# Altium schematic sheet Transmitter.SchDoc
size A; SheetNumber: 6; SheetTotal: 6
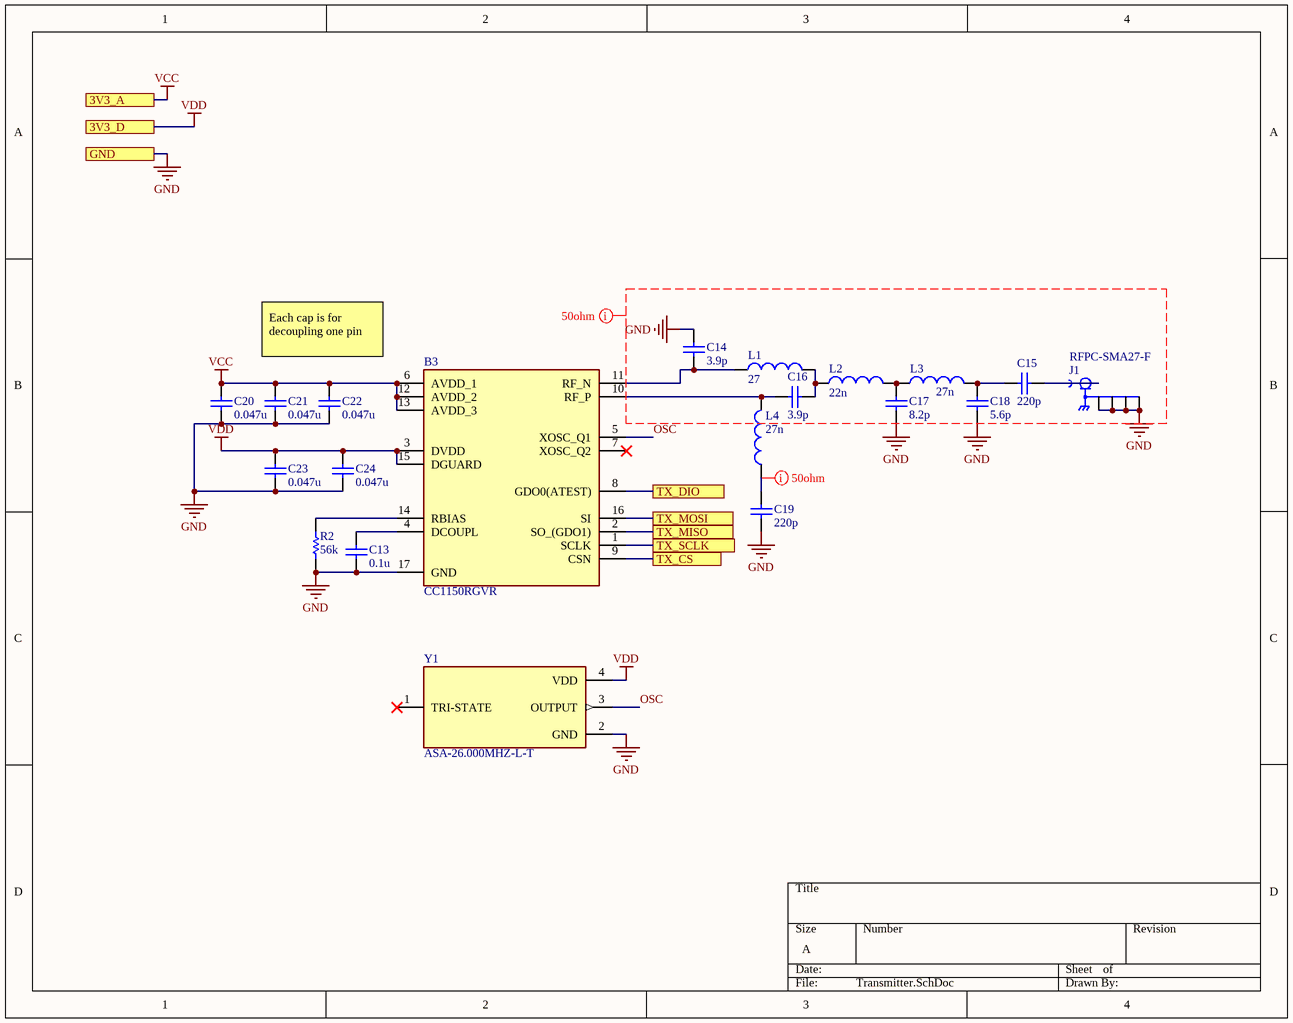
[diagram p0: Transmitter.SchDoc]

## Parts
B3  CC1150RGVR  [QFN65P400X400X100-17N-D]
C13  value 0.1u  (hidden comment: Capacitor)
C14  value 3.9p  (hidden comment: Capacitor)
C15  value 220p  (hidden comment: Capacitor)
C16  value 3.9p  (hidden comment: Capacitor)
C17  value 8.2p  (hidden comment: Capacitor)
C18  value 5.6p  (hidden comment: Capacitor)
C19  value 220p  (hidden comment: Capacitor)
C20  value 0.047u  (hidden comment: Capacitor)
C21  value 0.047u  (hidden comment: Capacitor)
C22  value 0.047u  (hidden comment: Capacitor)
C23  value 0.047u  (hidden comment: Capacitor)
C24  value 0.047u  (hidden comment: Capacitor)
J1  RFPC-SMA27-F  [GRADCONN_RFPC-SMA27-F]
L1  value 27  (hidden comment: Inductor)
L2  value 22n  (hidden comment: Inductor)
L3  value 27n  (hidden comment: Inductor)
L4  value 27n  (hidden comment: Inductor)
R2  value 56k  (hidden comment: Resistor)
Y1  ASA-26.000MHZ-L-T  [XTAL_ASA-26.000MHZ-L-T]

## Ports
3V3_A, 3V3_D, GND, TX_CS, TX_DIO, TX_MISO, TX_MOSI, TX_SCLK

## Nets
GND: B3.17(GND) C13.1 C14.2 C17.1 C18.1 C19.1 C20.1 C21.1 C22.1 C23.1 C24.1 J1.G1 J1.G2 J1.G3 J1.G4 R2.1 Y1.2(GND) ; port GND
VCC: B3.6(AVDD_1) B3.12(AVDD_2) B3.13(AVDD_3) C20.2 C21.2 C22.2 ; port 3V3_A
VDD: B3.3(DVDD) B3.15(DGUARD) C23.2 C24.2 Y1.4(VDD) ; port 3V3_D
OSC: B3.5(XOSC_Q1) Y1.3(OUTPUT)
TX_CS: B3.9(CSN) ; port TX_CS
TX_DIO: B3.8(GDO0(ATEST)) ; port TX_DIO
TX_MISO: B3.2(SO_(GDO1)) ; port TX_MISO
TX_MOSI: B3.16(SI) ; port TX_MOSI
TX_SCLK: B3.1(SCLK) ; port TX_SCLK
NetB3_4: B3.4(DCOUPL) C13.2
NetB3_10: B3.10(RF_P) C16.2 L4.2
NetB3_11: B3.11(RF_N) C14.1 L1.1
NetB3_14: B3.14(RBIAS) R2.2
NetC15_1: C15.1 J1.1
NetC15_2: C15.2 C18.2 L3.2
NetC16_1: C16.1 L1.2 L2.1
NetC17_2: C17.2 L2.2 L3.1
NetC19_2: C19.2 L4.1

Not connected (* = marked no-connect by the designer): B3 7(XOSC_Q2)*; Y1 1(TRI-STATE)*

## Layout directives
mark named 50ohm: GND, NetC19_2

## Notes on the sheet
- Each cap is for decoupling one pin

## Library data of the parts
B3 = CC1150RGVR: Highly Integrated Multichannel RF Transmitter Designed for Low-Power Wireless Applications; Manufacturer_Name: Texas Instruments; Geometry.Height: 1mm; Mouser Part Number: 595-CC1150RGVR; Mouser Price/Stock: https://www.mouser.com/Search/Refine.aspx?Keyword=595-CC1150RGVR; Manufacturer_Part_Number: CC1150RGVR; Datasheet Link: http://www.ti.com/lit/gpn/CC1150
C13-C24 = Capacitor: SimulationGenericComponent: True
J1 = CMP-012-000000-1: MF: {'manufacturer': u'GCT (Gradconn)'}; MP: RFPC-SMA27-F; Value: *; Pin Count: 5; Source: RFPC-SMA27-F.SchLib; Package: None; Price: None; Design Item ID: RFPC-SMA27-F; Component Type: Standard; Availability: Unavailable
L1-L4 = Inductor: SimulationGenericComponent: True
R2 = Resistor: TC1: 0; SimulationGenericComponent: True; TC2: 0
Y1 = CMP-010-000000-1: Design Item ID: ASA-26.000MHZ-L-T; Price: None; Package: None; Component Type: Standard; Source: ASA-26.000MHZ-L-T.SchLib; Value: *; Availability: Unavailable; Pin Count: 4; MP: ASA-26.000MHZ-L-T